# EAGLE schematic STM32F407layout (EAGLE 7.5.0)
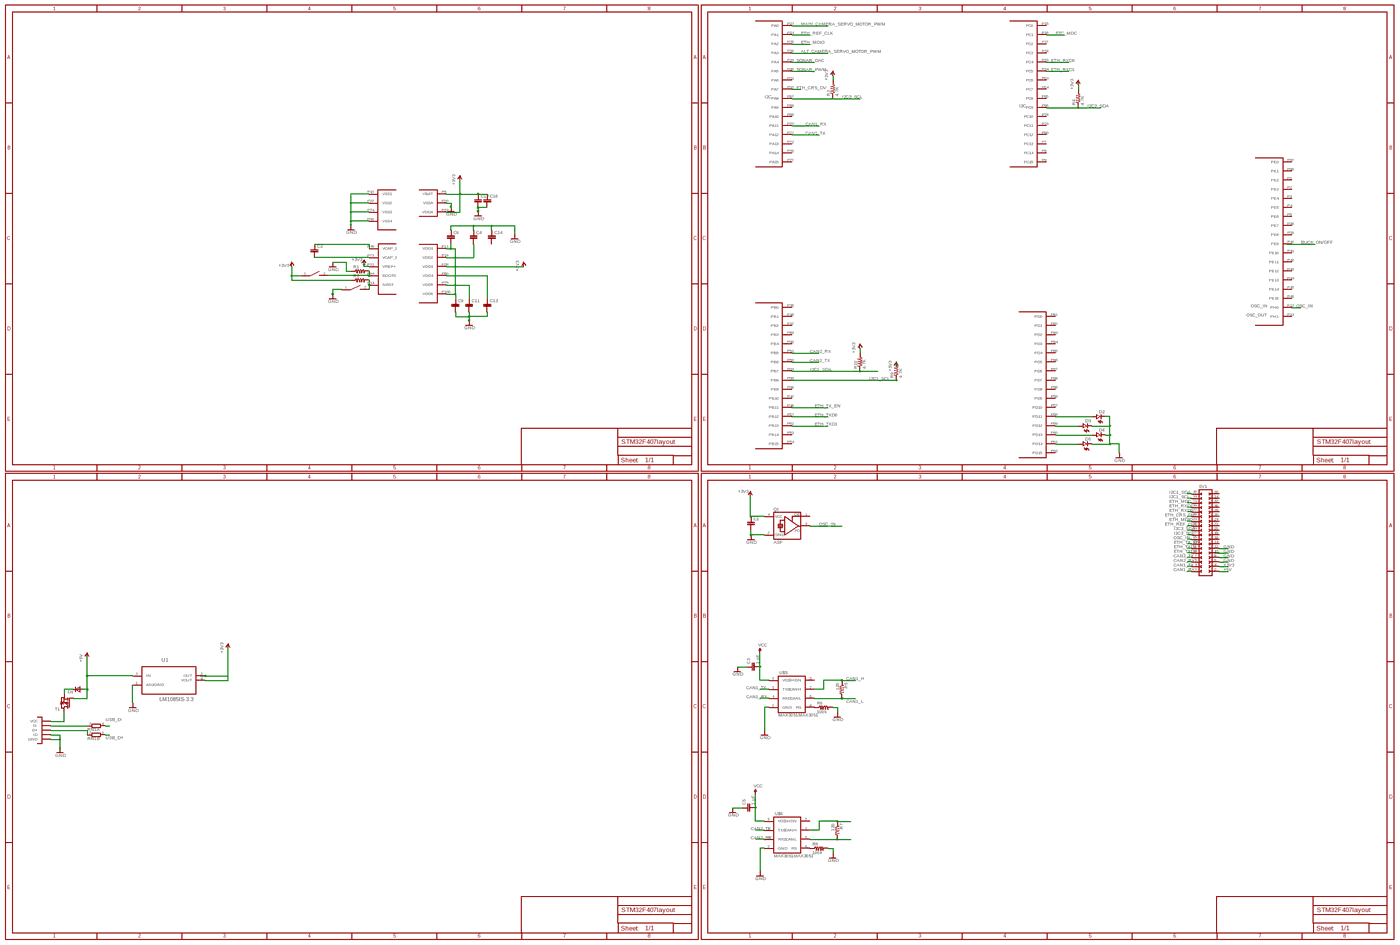
[diagram p0: schematic, sheet 1, overview]
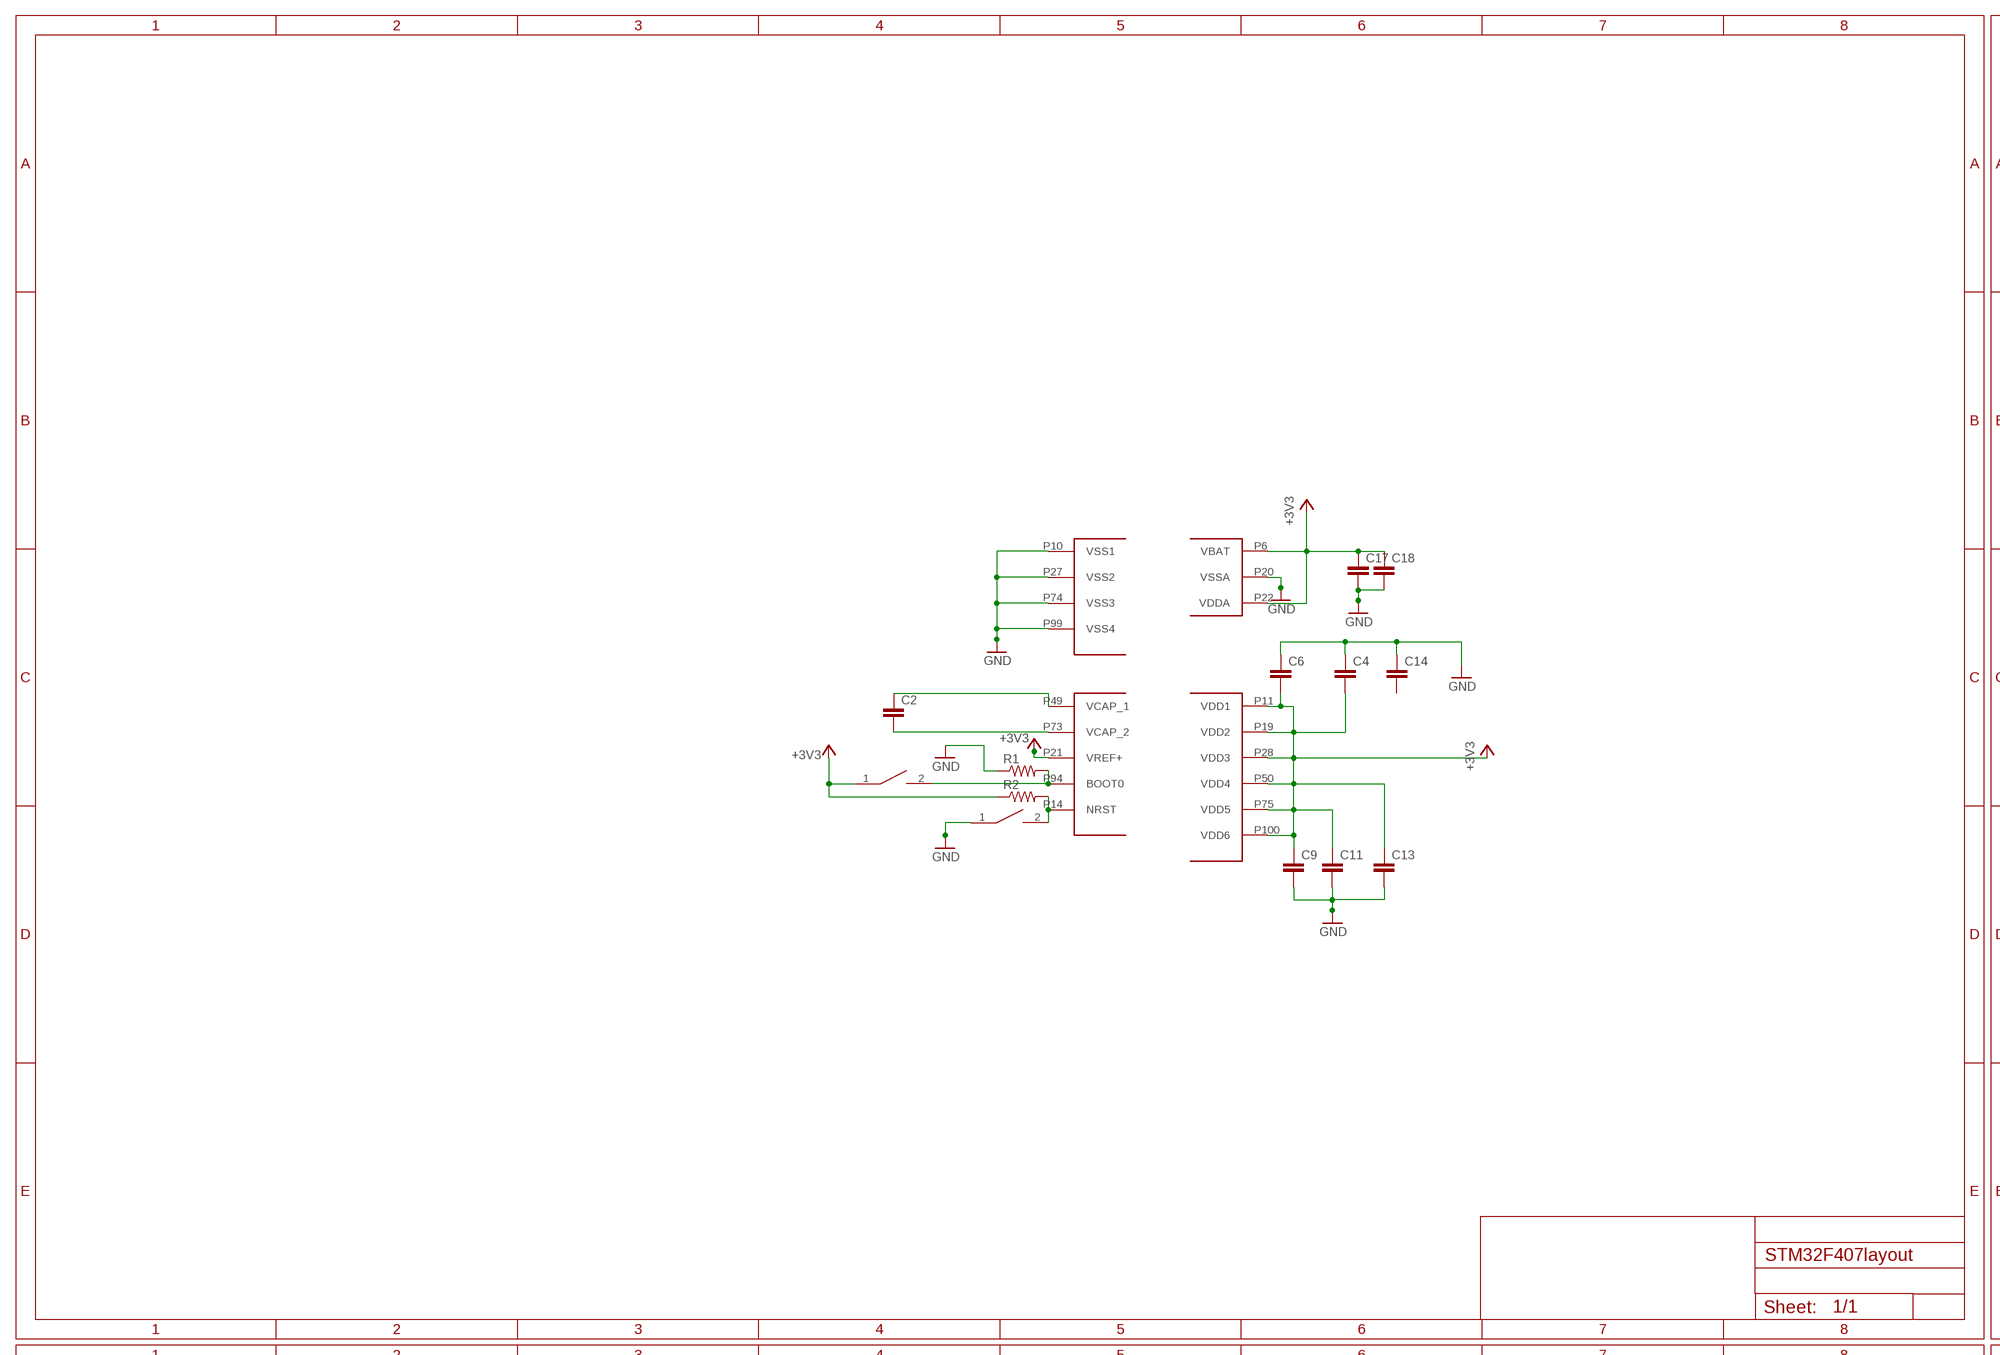
[diagram p1: schematic, sheet 1, part 1 of 4]
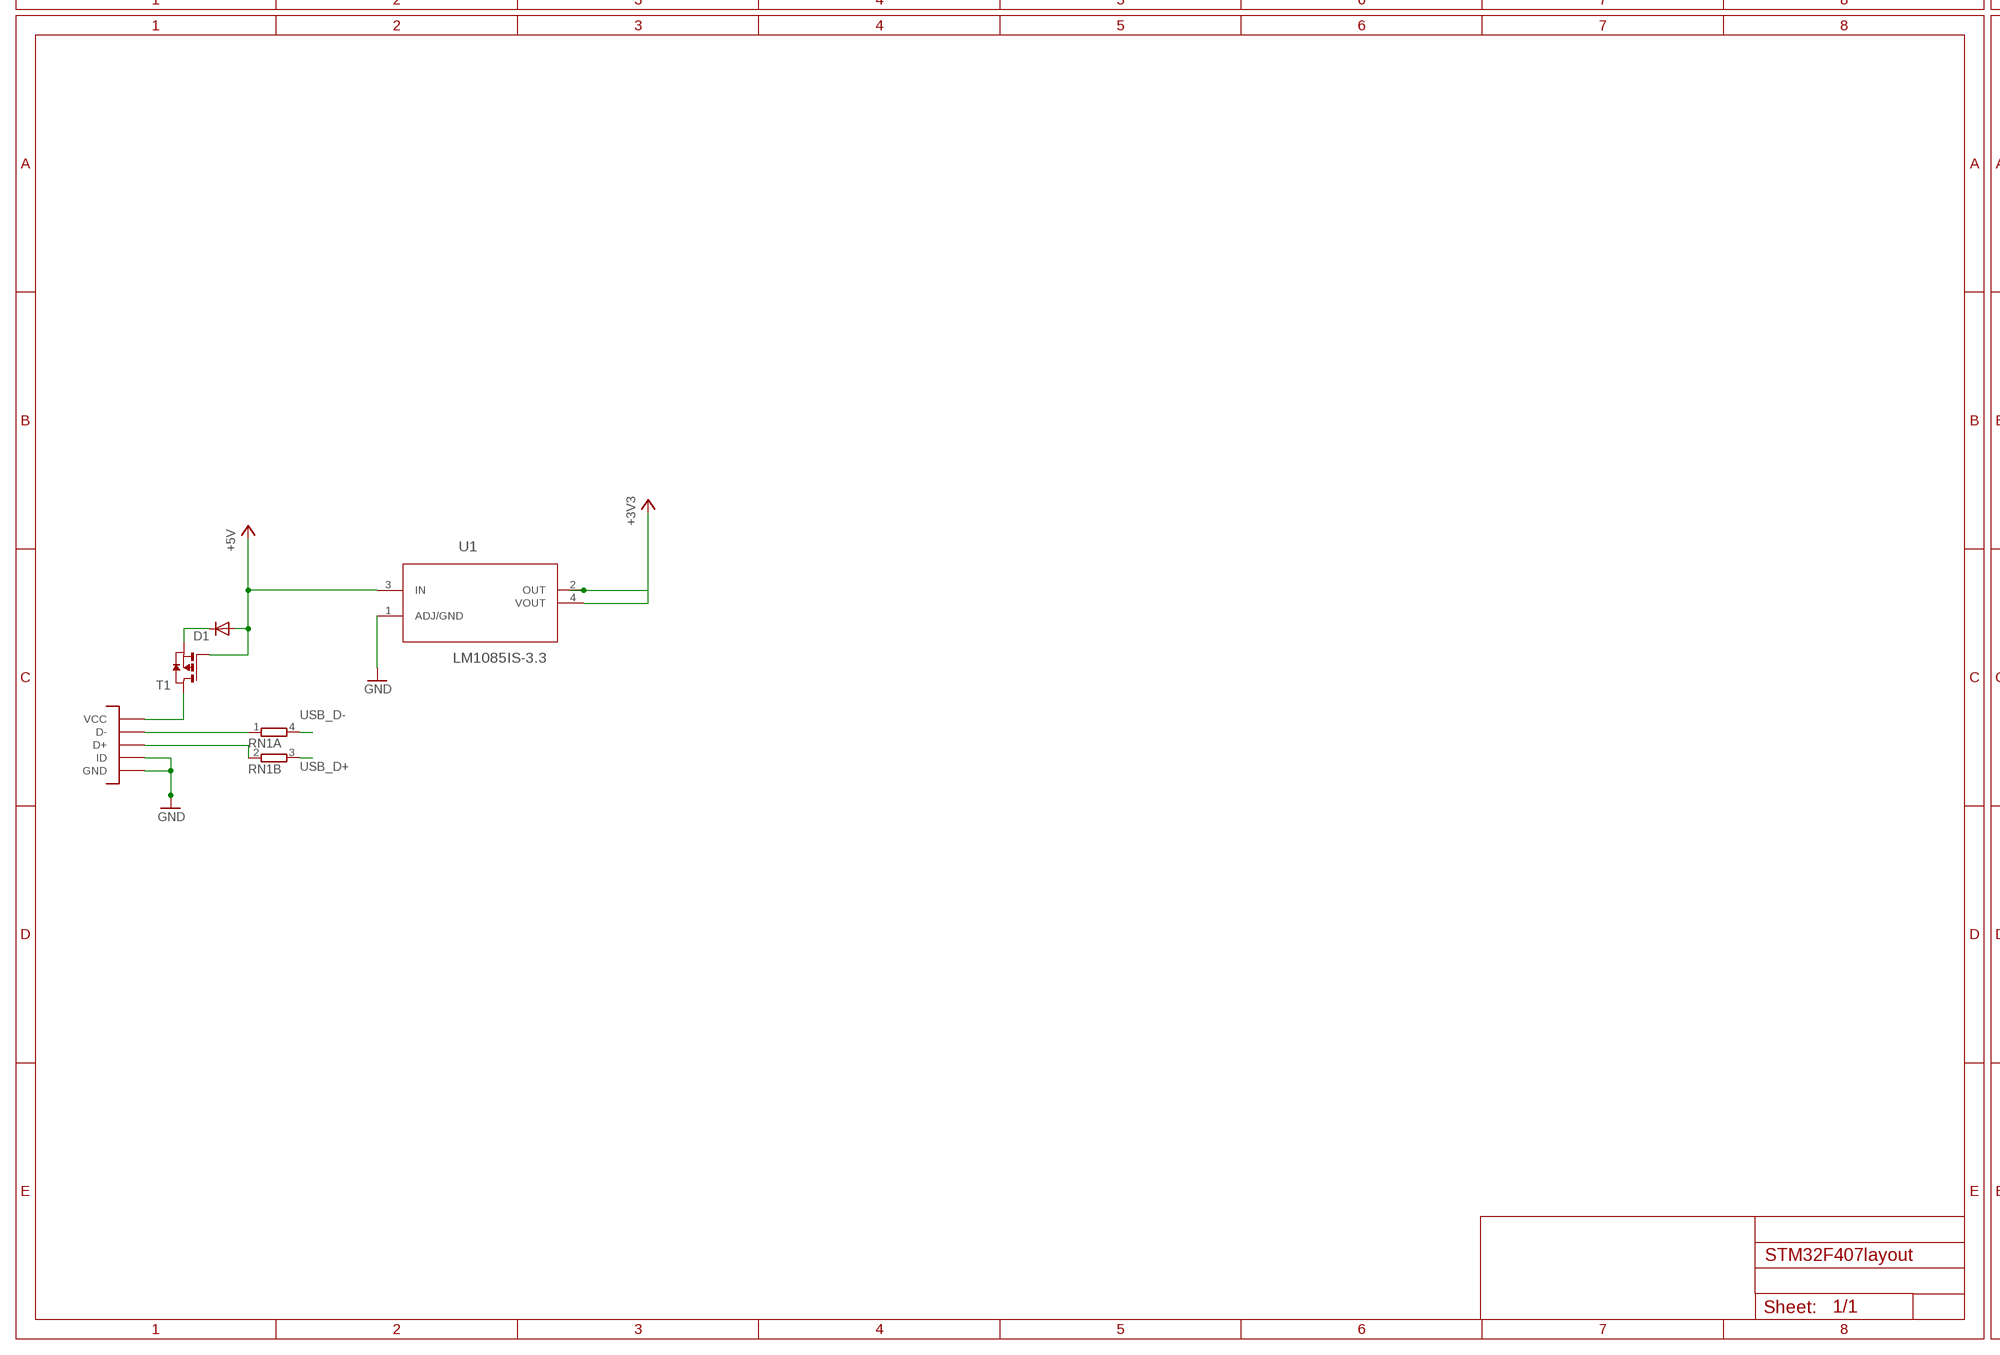
[diagram p2: schematic, sheet 1, part 2 of 4]
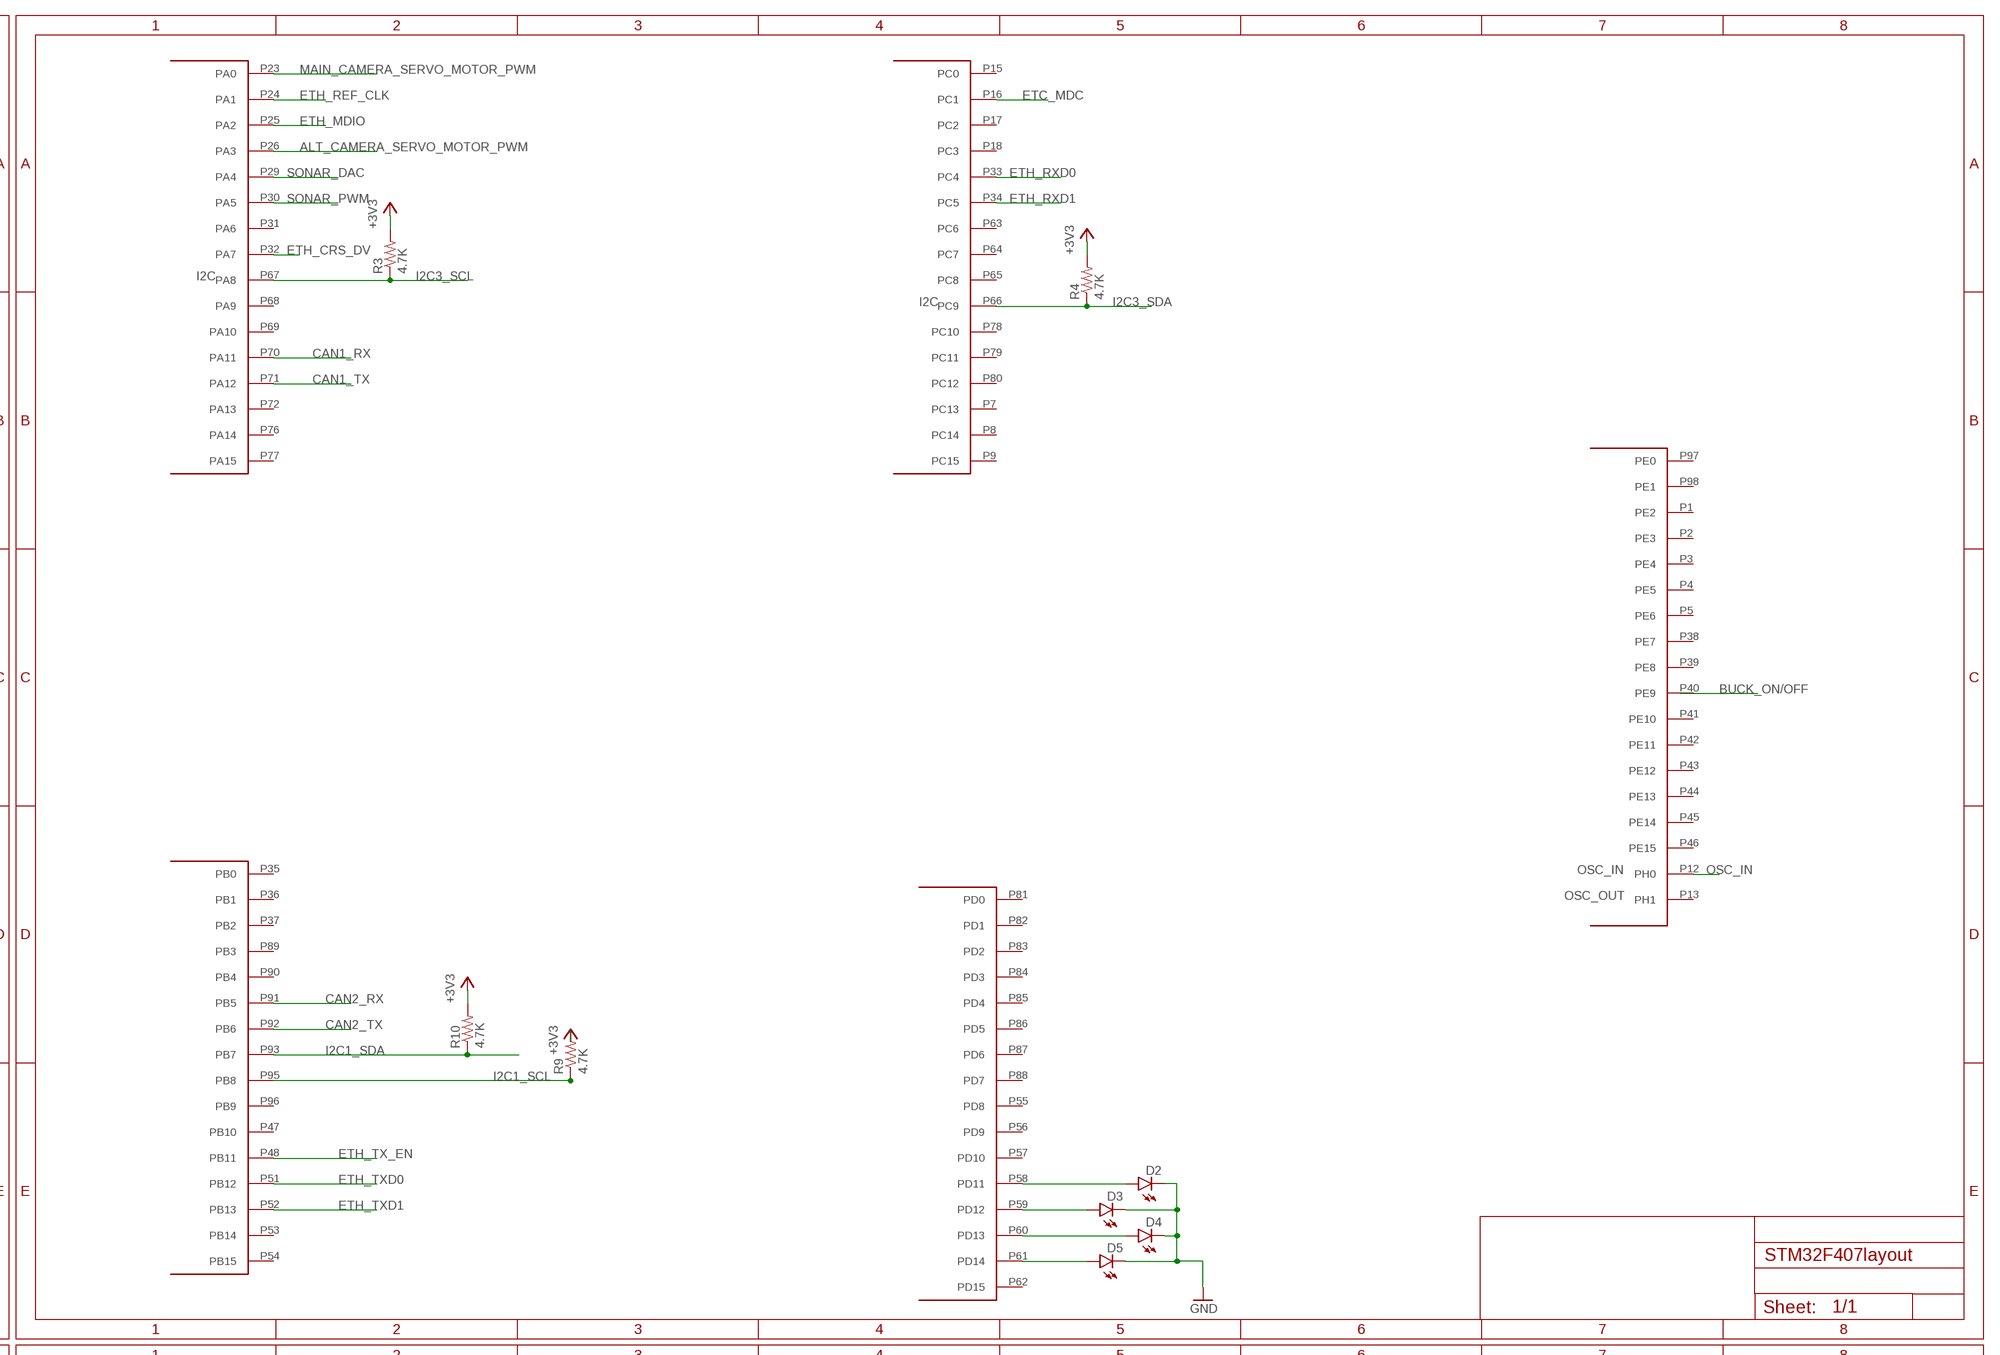
[diagram p3: schematic, sheet 1, part 3 of 4]
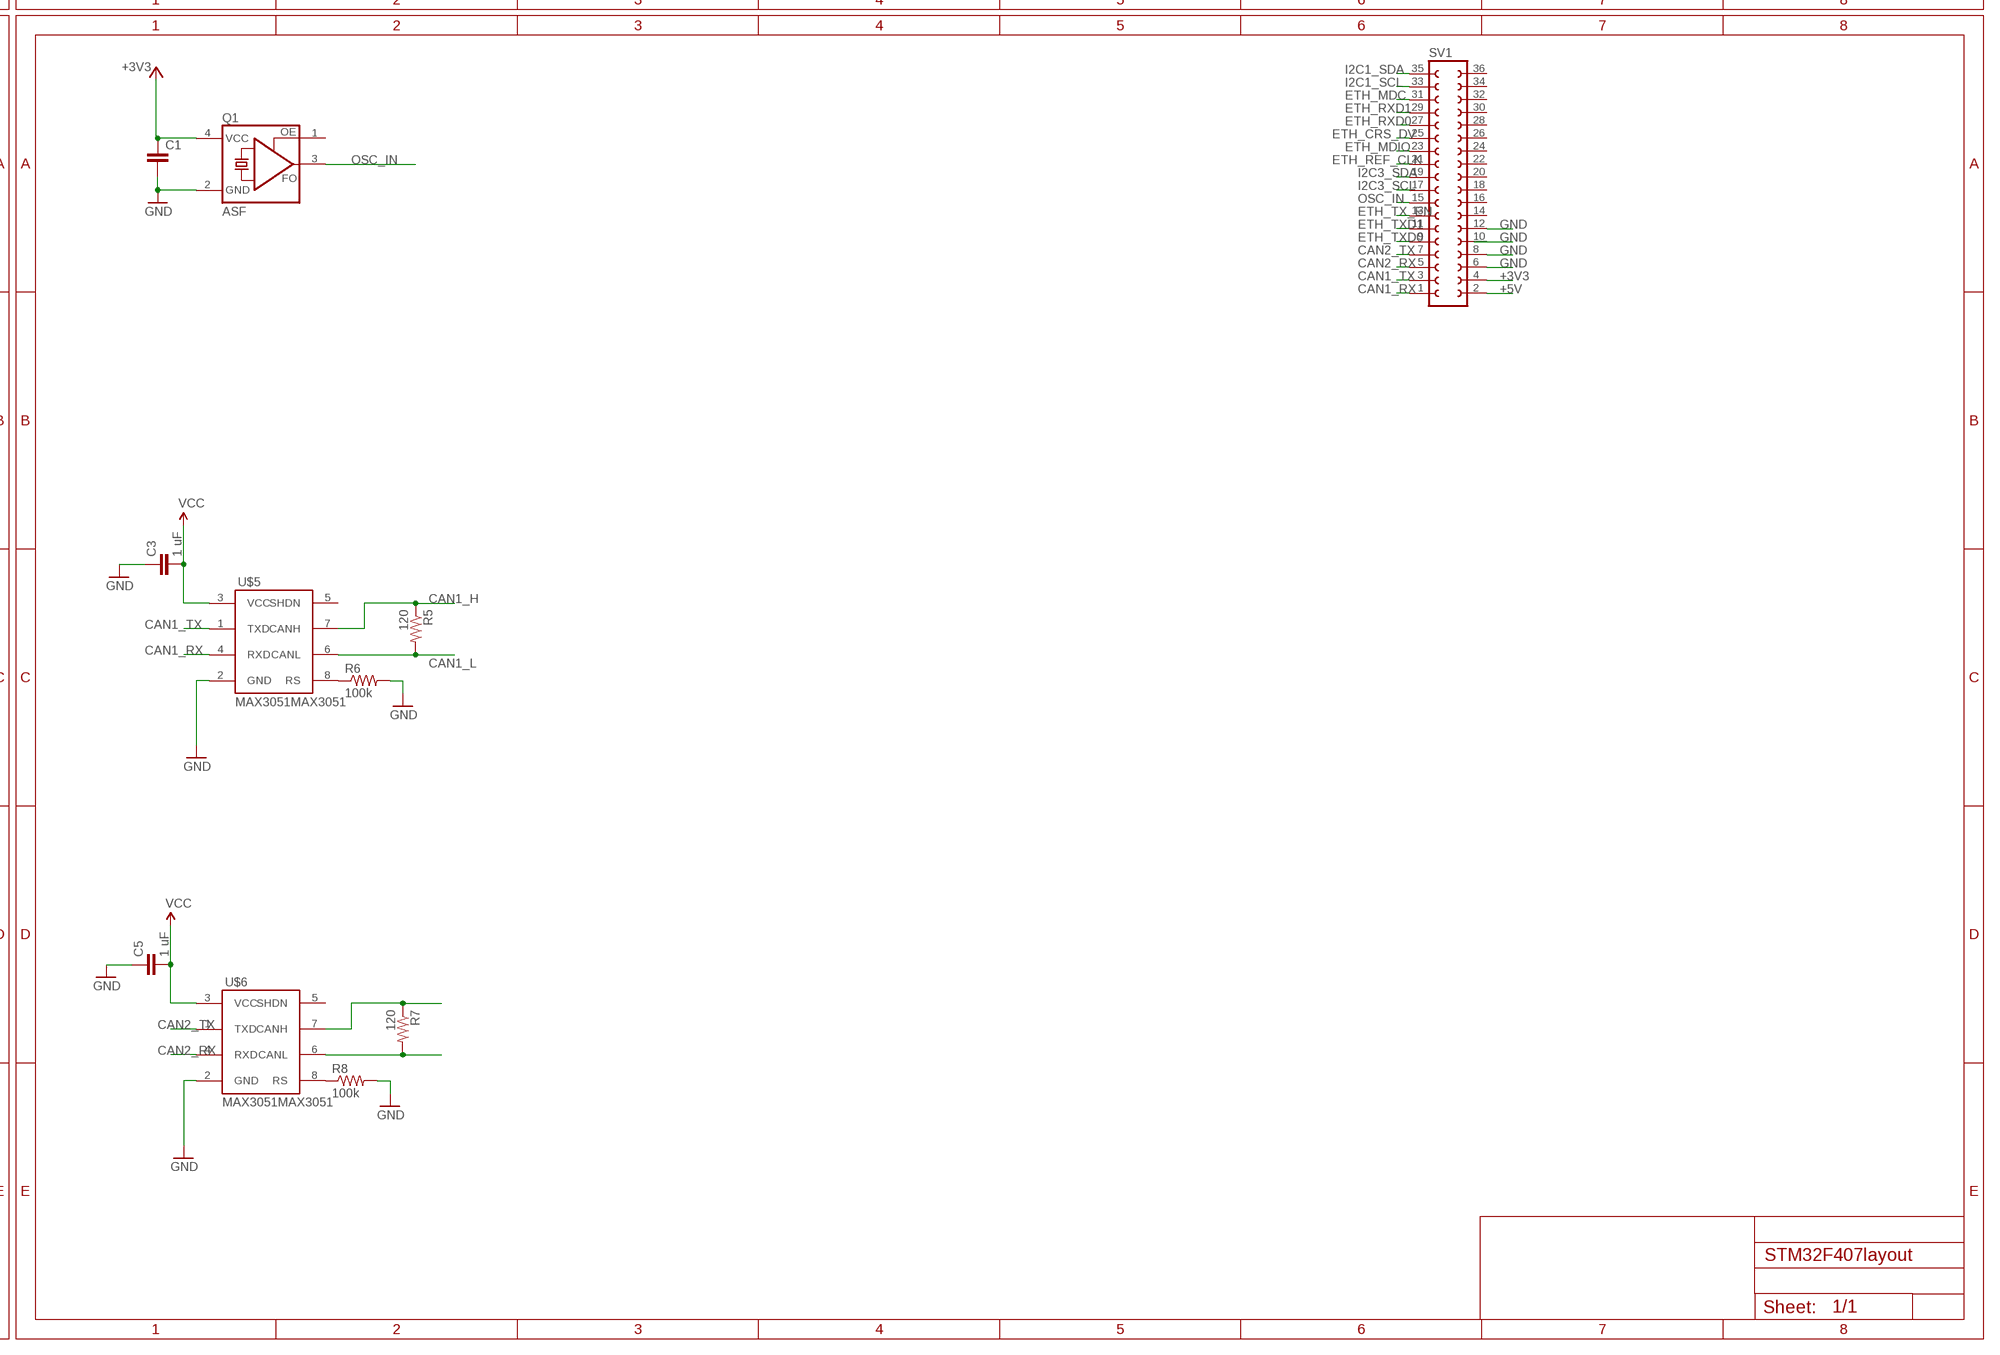
[diagram p4: schematic, sheet 1, part 4 of 4]

## Parts
C1  CAP0603-CAP  [0603-CAP]
C2  CAP0603-CAP  [0603-CAP]
C3  1 uF  C2,5-3  [C2.5-3]
C4  CAP0603-CAP  [0603-CAP]
C5  1 uF  C2,5-3  [C2.5-3]
C6  CAP0603-CAP  [0603-CAP]
C9  CAP0603-CAP  [0603-CAP]
C11  CAP0603-CAP  [0603-CAP]
C13  CAP0603-CAP  [0603-CAP]
C14  CAP0603-CAP  [0603-CAP]
C17  CAP0603-CAP  [0603-CAP]
C18  CAP0603-CAP  [0603-CAP]
D1  DIODE-DO-214AC  [DO-214AC]
D2  LED0603  [LED-0603]
D3  LED0603  [LED-0603]
D4  LED0603  [LED-0603]
D5  LED0603  [LED-0603]
Q1  ASF  [ASF]
R1  RESISTOR0603-RES  [0603-RES]
R2  RESISTOR0603-RES  [0603-RES]
R3  4.7K  RESISTOR0603-RES  [0603-RES]
R4  4.7K  RESISTOR0603-RES  [0603-RES]
R5  120  R-US_0204/2V  [0204V]
R6  100k  R-US_0204/2V  [0204V]
R7  120  R-US_0204/2V  [0204V]
R8  100k  R-US_0204/2V  [0204V]
R9  4.7K  RESISTOR0603-RES  [0603-RES]
R10  4.7K  RESISTOR0603-RES  [0603-RES]
RN1  2R-NEXBV4V  [EXBV4V]
SV1  FE18-2  [FE18-2]
T1  FDN340P  [SOT-23]
U1  LM1085IS-3.3  [TO254P1435X457-3N]
U$1  STM32F4  [LQFP100]
U$2  SWITCH  [SW_2512]
U$3  SWITCH  [SW_2512]
U$4  MICROUSB  [MICRO_B]
U$5  MAX3051MAX3051  [SOT23-8L]
U$6  MAX3051MAX3051  [SOT23-8L]

## Nets
+3V3: C4.2 C6.2 C9.1 C11.1 C13.1 C17.1 C18.1 R2.1 R3.2 R4.2 R9.2 R10.2 SV1.4 U1.2(OUT) U1.4(VOUT) U$1.P6(VBAT) U$1.P11(VDD1) U$1.P19(VDD2) U$1.P21(VREF+) U$1.P22(VDDA) U$1.P28(VDD3) U$1.P50(VDD4) U$1.P75(VDD5) U$1.P100(VDD6) U$3.1
+5V: D1.A SV1.2 T1.3(G) U1.3(IN)
ALT_CAMERA_SERVO_MOTOR_PWM: U$1.P26(PA3)
CAN1_H: R5.1 U$5.7(CANH)
CAN1_L: R5.2 U$5.6(CANL)
CAN1_RX: RN1.4 SV1.1 U$1.P70(PA11) U$5.4(RXD)
CAN1_TX: RN1.3 SV1.3 U$1.P71(PA12) U$5.1(TXD)
CAN2_RX: SV1.5 U$1.P91(PB5) U$6.4(RXD)
CAN2_TX: SV1.7 U$1.P92(PB6) U$6.1(TXD)
CANH1: R7.1 U$6.7(CANH)
CANL1: R7.2 U$6.6(CANL)
ETC_MDC: U$1.P16(PC1)
ETH_CRS_DV: SV1.25 U$1.P32(PA7)
ETH_MDC: SV1.31
ETH_MDIO: SV1.23 U$1.P25(PA2)
ETH_REF_CLK: SV1.21 U$1.P24(PA1)
ETH_RXD0: SV1.27 U$1.P33(PC4)
ETH_RXD1: SV1.29 U$1.P34(PC5)
ETH_TX_EN: SV1.13 U$1.P48(PB11)
ETH_TXD0: SV1.9 U$1.P51(PB12)
ETH_TXD1: SV1.11 U$1.P52(PB13)
GND: C1.2 C3.1 C4.1 C5.1 C6.1 C9.2 C11.2 C13.2 C14.1 C17.2 C18.2 D2.C D3.C D4.C D5.C Q1.2(GND) R1.1 R6.2 R8.2 SV1.6 SV1.8 SV1.12 U1.1(ADJ/GND) U$1.P10(VSS1) U$1.P20(VSSA) U$1.P27(VSS2) U$1.P74(VSS3) U$1.P99(VSS4) U$2.1 U$4.GND1(GND) U$4.GND2(GND) U$4.GND3(GND) U$4.GND4(GND) U$4.GND7(GND) U$4.GND8(GND) U$4.P4(ID) U$4.P5(GND) U$5.2(GND) U$6.2(GND)
I2C1_SCL: R9.1 SV1.33 U$1.P95(PB8)
I2C1_SDA: R10.1 SV1.35 U$1.P93(PB7)
I2C3_SCL: R3.1 SV1.17 U$1.P67(PA8)
I2C3_SDA: R4.1 SV1.19 U$1.P66(PC9)
MAIN_CAMERA_SERVO_MOTOR_PWM: U$1.P23(PA0)
N$1: C2.1 U$1.P49(VCAP_1)
N$2: C2.2 U$1.P73(VCAP_2)
N$3: R1.2 U$1.P94(BOOT0) U$3.2
N$4: R2.2 U$1.P14(NRST) U$2.2
N$5: D1.C T1.2(S)
N$6: RN1.2 U$4.P3(D+)
N$7: RN1.1 U$4.P2(D-)
N$10: T1.1(D) U$4.P1(VCC)
N$11: R6.1 U$5.8(RS)
N$12: C1.1 Q1.4(VCC)
N$13: R8.1 U$6.8(RS)
N$14: D2.A U$1.P58(PD11)
N$15: D3.A U$1.P59(PD12)
N$16: D4.A U$1.P60(PD13)
N$17: D5.A U$1.P61(PD14)
OSC_IN: Q1.3(FO) SV1.15 U$1.P12(PH0)
SONAR_DAC: U$1.P29(PA4)
SONAR_PWM: U$1.P30(PA5)
VCC: C3.2 C5.2 U$5.3(VCC) U$6.3(VCC)
Unconnected: C14.2 Q1.1(OE) SV1.10 SV1.14 SV1.16 SV1.18 SV1.20 SV1.22 SV1.24 SV1.26 SV1.28 SV1.30 SV1.32 SV1.34 SV1.36 U$1.P1(PE2) U$1.P2(PE3) U$1.P3(PE4) U$1.P4(PE5) U$1.P5(PE6) U$1.P7(PC13) U$1.P8(PC14) U$1.P9(PC15) U$1.P13(PH1) U$1.P15(PC0) U$1.P17(PC2) U$1.P18(PC3) U$1.P31(PA6) U$1.P35(PB0) U$1.P36(PB1) U$1.P37(PB2) U$1.P38(PE7) U$1.P39(PE8) U$1.P40(PE9) U$1.P41(PE10) U$1.P42(PE11) U$1.P43(PE12) U$1.P44(PE13) U$1.P45(PE14) U$1.P46(PE15) U$1.P47(PB10) U$1.P53(PB14) U$1.P54(PB15) U$1.P55(PD8) U$1.P56(PD9) U$1.P57(PD10) U$1.P62(PD15) U$1.P63(PC6) U$1.P64(PC7) U$1.P65(PC8) U$1.P68(PA9) U$1.P69(PA10) U$1.P72(PA13) U$1.P76(PA14) U$1.P77(PA15) U$1.P78(PC10) U$1.P79(PC11) U$1.P80(PC12) U$1.P81(PD0) U$1.P82(PD1) U$1.P83(PD2) U$1.P84(PD3) U$1.P85(PD4) U$1.P86(PD5) U$1.P87(PD6) U$1.P88(PD7) U$1.P89(PB3) U$1.P90(PB4) U$1.P96(PB9) U$1.P97(PE0) U$1.P98(PE1) U$5.5(SHDN) U$6.5(SHDN)

## Notes on the sheet
- I2C
- I2C
- USB_D-
- USB_D+

## Library data of the parts
C1 C2 C4 C6 C9 C11 C13 C14 C17 C18 = SparkFun-Passives:CAP: Capacitor Standard 0603 ceramic capacitor, and 0.1" leaded capacitor.
C3 C5 = capacitor-wima:C: CAPACITOR naming: grid - package width
D1 = DiscreteComponents:DIODE-: DIODE
D2-D5 = SparkFun-LED:LED: LEDs Standard schematic elements and footprints for 5mm, 3mm, 1206, and 0603 sized LEDs. 5mm - Spark Fun Electronics SKU : COM-00529 (and others)
Q1 = DiscreteComponents:ASF*: CRYSTAL CLOCK OSCILLATORS 5.0 Vdc or 3.3 Vdc - LOW PROFILE ULTRA MINIATURE CERAMIC SURFACE MOUNT Source: http://www.abracon.com/Oscillators/asf1-L-L1.pdf; DIGIKEY: 535-10066-1-ND
R1-R4 R9 R10 = SparkFun-Passives:RESISTOR: Resistor Basic schematic elements and footprints for 0603, 1206, and PTH resistors.
R5-R8 = resistor:R-US_: RESISTOR, American symbol
RN1 = DiscreteComponents:2R-N: Array Chip Resistor; DIGIKEY: RHM1381CT-ND; MF: Rohm Semiconductor; MPN: MNR12ERAPJ220
SV1 = Connectors:FE18-2: FEMALE HEADER; OC_FARNELL: unknown; OC_NEWARK: unknown
T1 = DiscreteComponents:FDN340P: MOS FET; DIGIKEY: FDN340PCT-ND
U1 = PowerComponents:LM1085IS-3.3: Low Dropout Positive Regulators; MPN: LM1085IS-3.3; OC_FARNELL: 1469039; OC_NEWARK: 41K3373; PACKAGE: TO-263-3; SUPPLIER: National Semiconductor
U$1 = Other:STM32F4
U$2 U$3 = DiscreteComponents:SWITCH
U$4 = Other:MICROUSB
U$5 U$6 = MAX3051 Library:MAX3051: Maxim Integrated MAX3051 CAN Tranciever